# Altium schematic sheet power_board.SchDoc
size A3
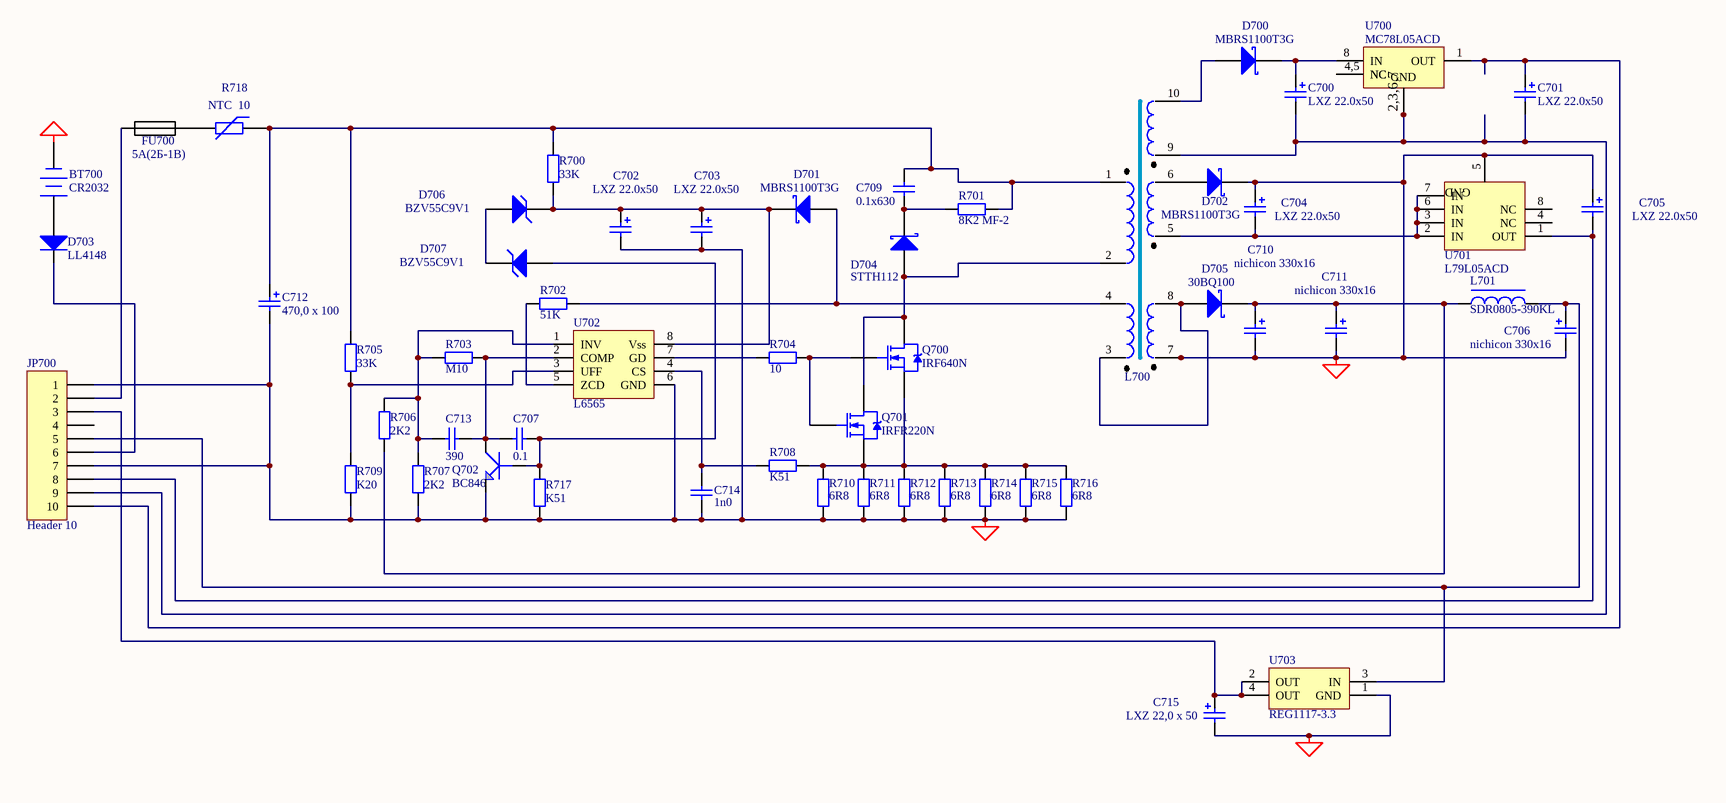
[diagram p0: power_board.SchDoc]

## Parts
BT700  CR2032  [BAT_SUPP]
C700  LXZ 22.0x50  [el3]
C701  LXZ 22.0x50  [el3]
C702  LXZ 22.0x50  [el3]
C703  LXZ 22.0x50  [el3]
C704  LXZ 22.0x50  [el3]
C705  LXZ 22.0x50  [el3]
C706  nichicon 330x16  [el5]
C707  0.1  [_1206]
C709  0.1x630  [c15]
C710  nichicon 330x16  [el5]
C711  nichicon 330x16  [el5]
C712  470,0 x 100  [el_15_25_h]
C713  390  [_1206]
C714  1n0  [_1206]
C715  LXZ 22,0 x 50  [el3]
D700  MBRS1100T3G  [D_6_3]
D701  MBRS1100T3G  [D_6_3]
D702  MBRS1100T3G  [D_6_3]
D703  LL4148  [_1206d]
D704  STTH112  [D_6_3]
D705  30BQ100  [30BQ100]
D706  BZV55C9V1  [_1206d]
D707  BZV55C9V1  [_1206d]
FU700  5A(2Б-1В)  [FUSE2]
JP700  Header 10  [HDR2X5]
L700  L220-K10  [trans_ring1]  (value not drawn)
L701  SDR0805-390KL  [L10x10]
Q700  IRF640N  [TO220_h]
Q701  IRFR220N  [SIP-G3/E13]
Q702  BC846  [SO-G3]
R700  33K  [_1206]
R701  8K2 MF-2  [AXIAL-0.7]
R702  51K  [_1206]
R703  M10  [_1206]
R704  10  [_1206]
R705  33K  [_1206]
R706  2K2  [_1206]
R707  2K2  [_1206]
R708  K51  [_1206]
R709  K20  [_1206]
R710  6R8  [_1206]
R711  6R8  [_1206]
R712  6R8  [_1206]
R713  6R8  [_1206]
R714  6R8  [_1206]
R715  6R8  [_1206]
R716  6R8  [_1206]
R717  K51  [_1206]
R718  NTC  10  [JVR07N]
U700  MC78L05ACD  [SO-G8]
U701  L79L05ACD  [SO-G8]
U702  L6565  [so-g8]
U703  REG1117-3.3  [DSO-G3]

## Nets
GND_p: BT700.2(-) C702.2 C703.2 C704.1 C705.1 C706.2 C710.2 C711.2 C712.2 C714.2 C715.2 D702.2(K) JP700.1 JP700.7 L700.7 Q702.2(E) R707.1 R709.1 R710.2 R711.2 R712.2 R713.2 R714.2 R715.2 R716.2 R717.1 U701.5(GND) U702.6(GND) U703.1(GND)
NetBT700_1: BT700.1(+) D703.1(A)
NetC700_1: C700.1 D700.2(K) U700.8(IN)
NetC700_2: C700.2 C701.2 JP700.9 L700.9 U700.2(GND) U700.3(GND) U700.6(GND) U700.7(GND)
NetC701_1: C701.1 JP700.10 U700.1(OUT)
NetC702_1: C702.1 C703.1 D701.2(K) D706.2(K) R700.2 U702.8(Vss)
NetC704_2: C704.2 L700.5 U701.2(IN) U701.3(IN) U701.6(IN) U701.7(IN)
NetC705_2: C705.2 JP700.8 U701.1(OUT)
NetC706_1: C706.1 JP700.5 L701.1 U703.3(IN)
NetC707_1: C707.1 C713.2 Q702.3(C) R703.1 U702.2(COMP)
NetC707_2: C707.2 D707.1(A) Q702.1(B) R717.2
NetC709_1: C709.1 D704.2(K) R701.2
NetC709_2: C709.2 C712.1 L700.1 R700.1 R701.1 R705.2 R718.1
NetC710_1: C710.1 C711.1 D705.2(K) L701.2 R706.1
NetC713_1: C713.1 R703.2 R706.2 R707.2 U702.1(INV)
NetC714_1: C714.1 R708.2 U702.4(CS)
NetC715_1: C715.1 JP700.3 U703.2(OUT) U703.4(OUT)
NetD700_1: D700.1(A) L700.10
NetD701_1: D701.1(A) L700.4 R702.1
NetD702_1: D702.1(A) L700.6
NetD703_2: D703.2(K) JP700.6
NetD704_1: D704.1(A) L700.2 Q700.2(D) Q701.2(D)
NetD705_1: D705.1(A) L700.3 L700.8
NetD706_1: D706.1(A) D707.2(K)
NetFU700_1: FU700.1 JP700.2
NetFU700_2: FU700.2 R718.2
NetQ700_1: Q700.1(G) Q701.1(G) R704.1
NetQ700_3: Q700.3(S) Q701.3(S) R708.1 R710.1 R711.1 R712.1 R713.1 R714.1 R715.1 R716.1
NetR702_2: R702.2 U702.5(ZCD)
NetR704_2: R704.2 U702.7(GD)
NetR705_1: R705.1 R709.2 U702.3(UFF)
NetU700_4: U700.4(NC) U700.5(NC)

Not connected (* = marked no-connect by the designer): JP700 4; U701 4(NC) 8(NC)

## Notes on the sheet
- (in symbol MC78L05ACD) 4,5; 2,3,6,7

## Library data of the parts
BT700 = Battery: Multicell Battery; Manufacturer: Generic Components; Published: 24-Mar-1999; Revision: July-2002: Re-released for DXP Platform.; Publisher: Altium Limited
C700 C701 = Cap Pol1: Polarized Capacitor (Radial); Manufacturer: Generic Components; Class I: Passive; Value: 10,0x25; Published: 8-Jun-2000; Revision: July-2002: Re-released for DXP Platform.; Publisher: Altium Limited; Class II: Capacitor
C702-C706 C710-C712 = Cap Pol1: Polarized Capacitor (Radial); Manufacturer: Generic Components; Class I: Passive; Value: 22,0x50; Published: 8-Jun-2000; Revision: July-2002: Re-released for DXP Platform.; Publisher: Altium Limited; Class II: Capacitor
C707 C709 C713 C714 = Cap Semi: Capacitor (Semiconductor SIM Model); Manufacturer: Generic Components; Class I: Passive; Value: 1,0; Published: 8-Jun-2000; Revision: July-2002: Re-released for DXP Platform.; Publisher: Altium Limited; Class II: Capacitor
C715 = Cap Pol1: Polarized Capacitor (Radial); Manufacturer: Generic Components; Class I: Passive; Published: 8-Jun-2000; Revision: July-2002: Re-released for DXP Platform.; Publisher: Altium Limited; Class II: Capacitor; Value: 22,0x50
D700-D702 D705 = 10BQ015: Schottky Rectifier; Manufacturer: International Rectifier; Revision 1: 10-July-2000: SIM Model Added.; Revision 2: July-2002: Re-released for DXP Platform.; Class I: Discrete; Class II: Rectifier - Schottky; Published: 8-Jun-2000; Datasheet: Latest Revision: PD-2.396A; Package Reference: DO-214AA; Publisher: Altium Limited
D703 = Diode: Default Diode; Manufacturer: Generic Components; Class I: Discrete; Class II: Diode - Switching; Published: 8-Jun-2000; Revision: July-2002: Re-released for DXP Platform.; Publisher: Altium Limited
D704 = 10BQ015: Schottky Diode; Manufacturer: International Rectifier; Revision 1: 10-July-2000: SIM Model Added.; Revision 2: July-2002: Re-released for DXP Platform.; Class I: Discrete; Class II: Rectifier - Schottky; Value: 10BQ100; Published: 8-Jun-2000; Datasheet: Latest Revision: PD-2.396A; Package Reference: DO-214AA; Publisher: Altium Limited
D706 D707 = D Zener: Zener Diode; Manufacturer: Generic Components; Class I: Discrete; Class II: Diode - Zener; Value: BZV55C3V9; Published: 8-Jun-2000; Revision: July-2002: Re-released for DXP Platform.; Publisher: Altium Limited
FU700 = FUSE
JP700 = Header 10: Header, 10-Pin; Manufacturer: Generic Components; Class I: Connector; Revision: July-2002: Re-released for DXP Platform.; Publisher: Altium Limited
L700 = L1_dc_2: Дроссель
L701 = Inductor Konstr 2: Magnetic-Core Inductor; Manufacturer: Generic Components; Class I: Passive; Published: 24-Mar-1999; Revision: July-2002: Re-released for DXP Platform.; Publisher: Altium Limited; Class II: Inductor
Q700 Q701 = NMOS-2: N-Channel Power MOSFET; Manufacturer: Generic Components; Class I: Discrete; Class II: MOSFET - Power; Note: Pin 2 is electrically connected to pin 4.; Published: 8-Jun-2000; Revision: July-2002: Re-released for DXP Platform.; Datasheet: Latest Revision: PD-9.814; Package Reference: TO-220AB; Publisher: Altium Limited
Q702 = GT122: Bipolar transistor; Right: 20; Bottom: 20; Value: BC846
R700-R717 = Res2: Resistor; Manufacturer: Generic Components; Class I: Passive; Value: 1K0; Rule: Undefined; Published: 8-Jun-2000; Revision: July-2002: Re-released for DXP Platform.; Publisher: Altium Limited; Class II: Resistor
R718 = Res Varistor: Varistor (Voltage-Sensitive Resistor); Manufacturer: Generic Components; Class I: Discrete; Published: 24-Mar-1999; Revision: July-2002: Re-released for DXP Platform.; Publisher: Altium Limited; Class II: Voltage-Sensitive Resistor
U700 = MC78L05ACD: 3-Terminal Low-Current Positive Fixed Voltage Regulator; Manufacturer: Motorola; Class I: Power Management; Published: 15-Apr-2002; Datasheet: Linear and Interface Integrated Circuits, DL128 Rev2 (1988); Package Reference: 751-02; Publisher: Altium Limited; Class II: Voltage Regulator
U701 = L79L05ACD: Negative Voltage Regulator; Manufacturer: ST-Microelectronics; Package Information: Latest Revision: Jul-1998; Class I: Power Management; Published: 24-Aug-2001; Revision: July-2002: Re-released for DXP Platform.; Datasheet: Latest Revision: Apr-1999; Package Reference: SO8; Publisher: Altium Limited; Class II: Voltage Regulator
U703 = REG1117-3.3: 800mA and 1A Low Dropout Positive Regulator 2.85V, 3.3V, 5V, and Adjustable; Manufacturer: Burr-Brown; Package Information: Latest Revision: Rev. C; Class I: Power Management; Class II: Voltage Regulator; Published: 8-Jun-2000; Revision: July-2002: Re-released for DXP Platform.; Datasheet: Latest Revision: Sep-1997; Package Reference: ZZ311; Publisher: Altium Limited